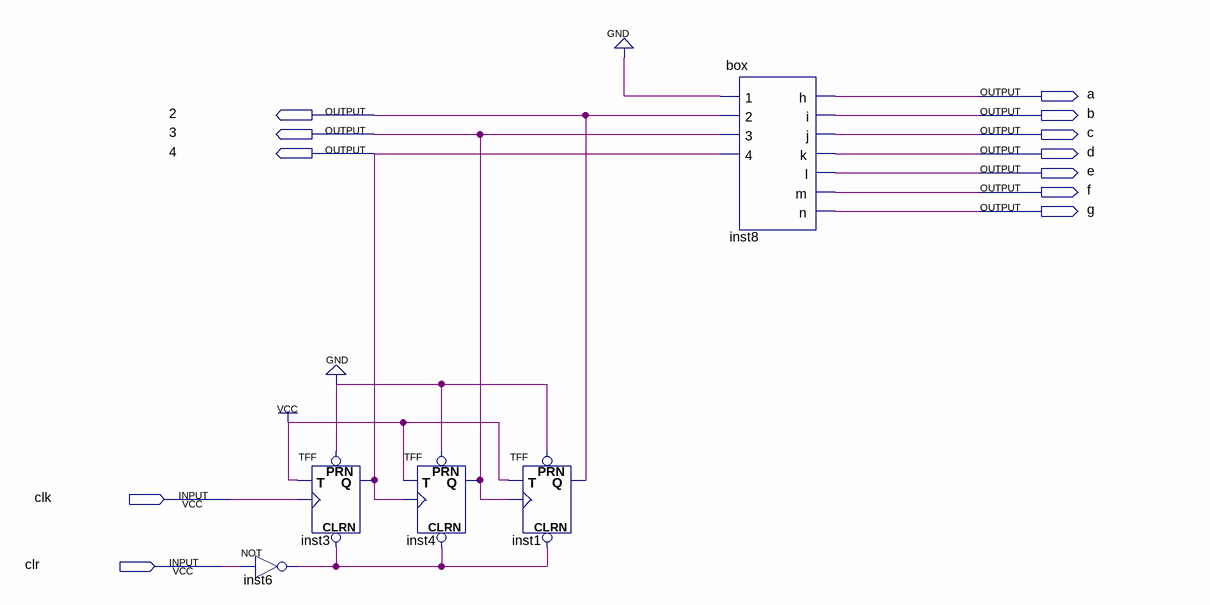
[diagram p0: schematic sheet]
// Quartus schematic bcd.bdf as structural Verilog: 5 symbols, 12 pins
module bcd (
  input  clk,
  input  clr,
  output a,
  output \2 ,
  output b,
  output \3 ,
  output c,
  output \4 ,
  output d,
  output e,
  output f,
  output g
);

  wire inst6_out;

  TFF inst3 (.PRN(1'b0), .CLRN(inst6_out), .T(1'b1), .CLK(clk), .Q(\4 ));
  not inst6 (inst6_out, clr);
  TFF inst4 (.PRN(1'b0), .CLRN(inst6_out), .T(1'b1), .CLK(\4 ), .Q(\3 ));
  TFF inst1 (.PRN(1'b0), .CLRN(inst6_out), .T(1'b1), .CLK(\3 ), .Q(\2 ));
  box inst8 (.\1 (1'b0), .\2 (\2 ), .\3 (\3 ), .\4 (\4 ), .h(a), .i(b), .j(c), .k(d), .l(e), .m(f), .n(g));
endmodule
